# Altium schematic sheet Sheet1.SchDoc
size A
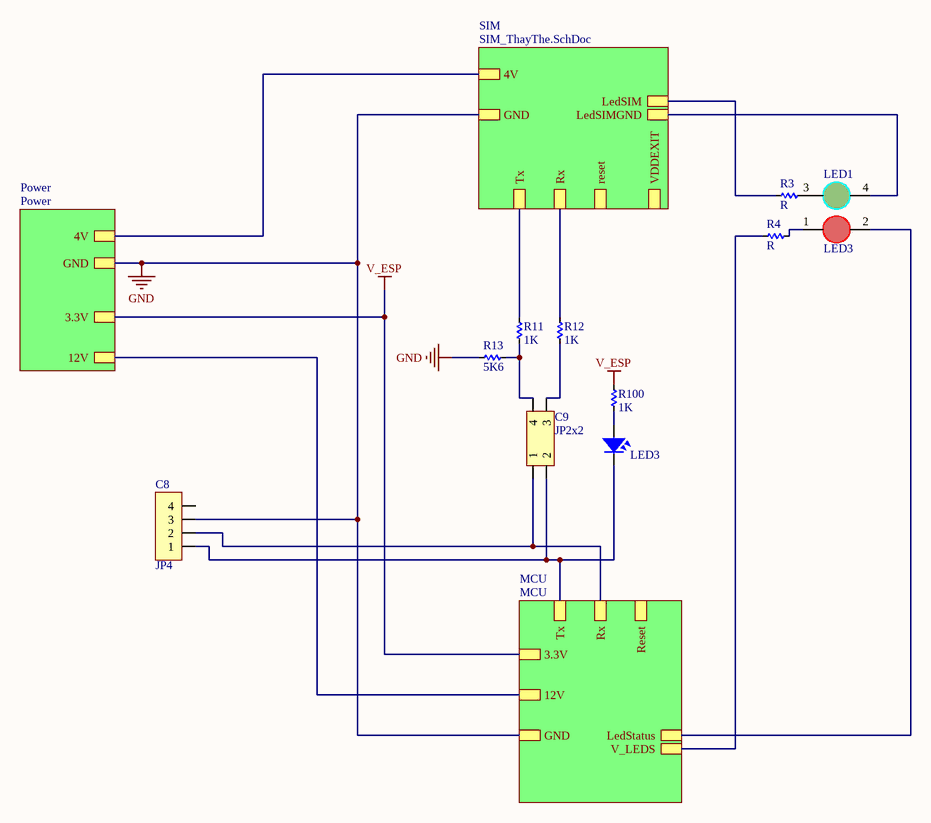
[diagram p0: Sheet1.SchDoc]

## Parts
C8  JP4  [JP4-C1T]
C9  JP2x2  [JP2-D2T]
LED1  LED3  [LedC]
LED3  LED  [LED-3MM-GREEN]  (value not drawn)
R3  R  [RES-SMD-0603_BIG]
R4  R  [RES-SMD-0603_BIG]
R11  1K  [RES-SMD-0805]
R12  1K  [RES-SMD-0805]
R13  5K6  [RES-SMD-0805]
R100  1K  [RES-SMD-0805]

## Sub-sheets
MCU = MCU: 3.3V, GND, Tx, Rx, Reset, 12V, LedStatus, V_LEDS
Power = Power: 4V, GND, 3.3V, 12V
SIM = SIM_ThayThe.SchDoc: 4V, GND, Tx, Rx, reset, VDDEXIT, LedSIM, LedSIMGND

## Nets
GND: C8.3 R13.2 ; sheet Power/GND, sheet SIM/GND, sheet MCU/GND
V_ESP: R100.2 ; sheet Power/3.3V, sheet MCU/3.3V
NetC8_1: C8.1 C9.2 LED3.2 ; sheet MCU/Tx
NetC8_2: C8.2 C9.1 ; sheet MCU/Rx
NetC9_3: C9.3 R12.2
NetC9_4: C9.4 R11.2 R13.1
NetLED1_1: LED1.1(A) R4.1
NetLED1_2: LED1.2(K) ; sheet MCU/LedStatus
NetLED1_3: LED1.3(A) R3.1
NetLED1_4: LED1.4(K) ; sheet SIM/LedSIMGND
NetLED3_1: LED3.1 R100.1
NetR3_2: R3.2 ; sheet SIM/LedSIM
NetR4_2: R4.2 ; sheet MCU/V_LEDS
NetR11_1: R11.1 ; sheet SIM/Tx
NetR12_1: R12.1 ; sheet SIM/Rx
(unnamed): sheet Power/4V, sheet SIM/4V
(unnamed): sheet Power/12V, sheet MCU/12V

Not connected (* = marked no-connect by the designer): C8 4

## Library data of the parts
C8 = JP4: WR-PHD 2.54 mm Angled Socket Header; Manufacturer: W¨¹rth Elektronik eiSos GmbH; partNo: 613004143121; ComponentLink1 Description: Manufacturer; ComponentLink2 Description: Datasheet; NoPins: 04; Created Date: 29 March 2013; ComponentLink1URL: http://www.we-online.com; ComponentLink2URL: http://katalog.we-online.de/em/datasheet/6130xx143121.pdf; Created by: Karrer Zheng
C9 = JP2x2: WR-PHD 2.54 mm Dual Socket Header; Manufacturer: W¨¹rth Elektronik eiSos GmbH; partNo: 61300421821; ComponentLink1 Description: Manufacturer; ComponentLink2 Description: Datasheet; NoPins: 04; Created Date: 29 March 2013; ComponentLink1URL: http://www.we-online.com; ComponentLink2URL: http://katalog.we-online.de/em/datasheet/6130xx21821.pdf; Created by: Karrer Zheng
LED1 = LED: LED 3mm
LED3 = LED: LED Single colour Green and Red; Value: LED 3 ly Single Colour
R11-R13 R100 = Res-SMD: Resistor; Manufacturer: Generic Components; Class: Passive; Published: 08/06/2000; Publisher: Altium Hobart Technology Centre